# Altium schematic sheet A5000_8MB_MEMCs.SchDoc: ARM2 to ARM3 Adapter
size A3; DocumentNumber: 1; SheetNumber: 2; SheetTotal: 5
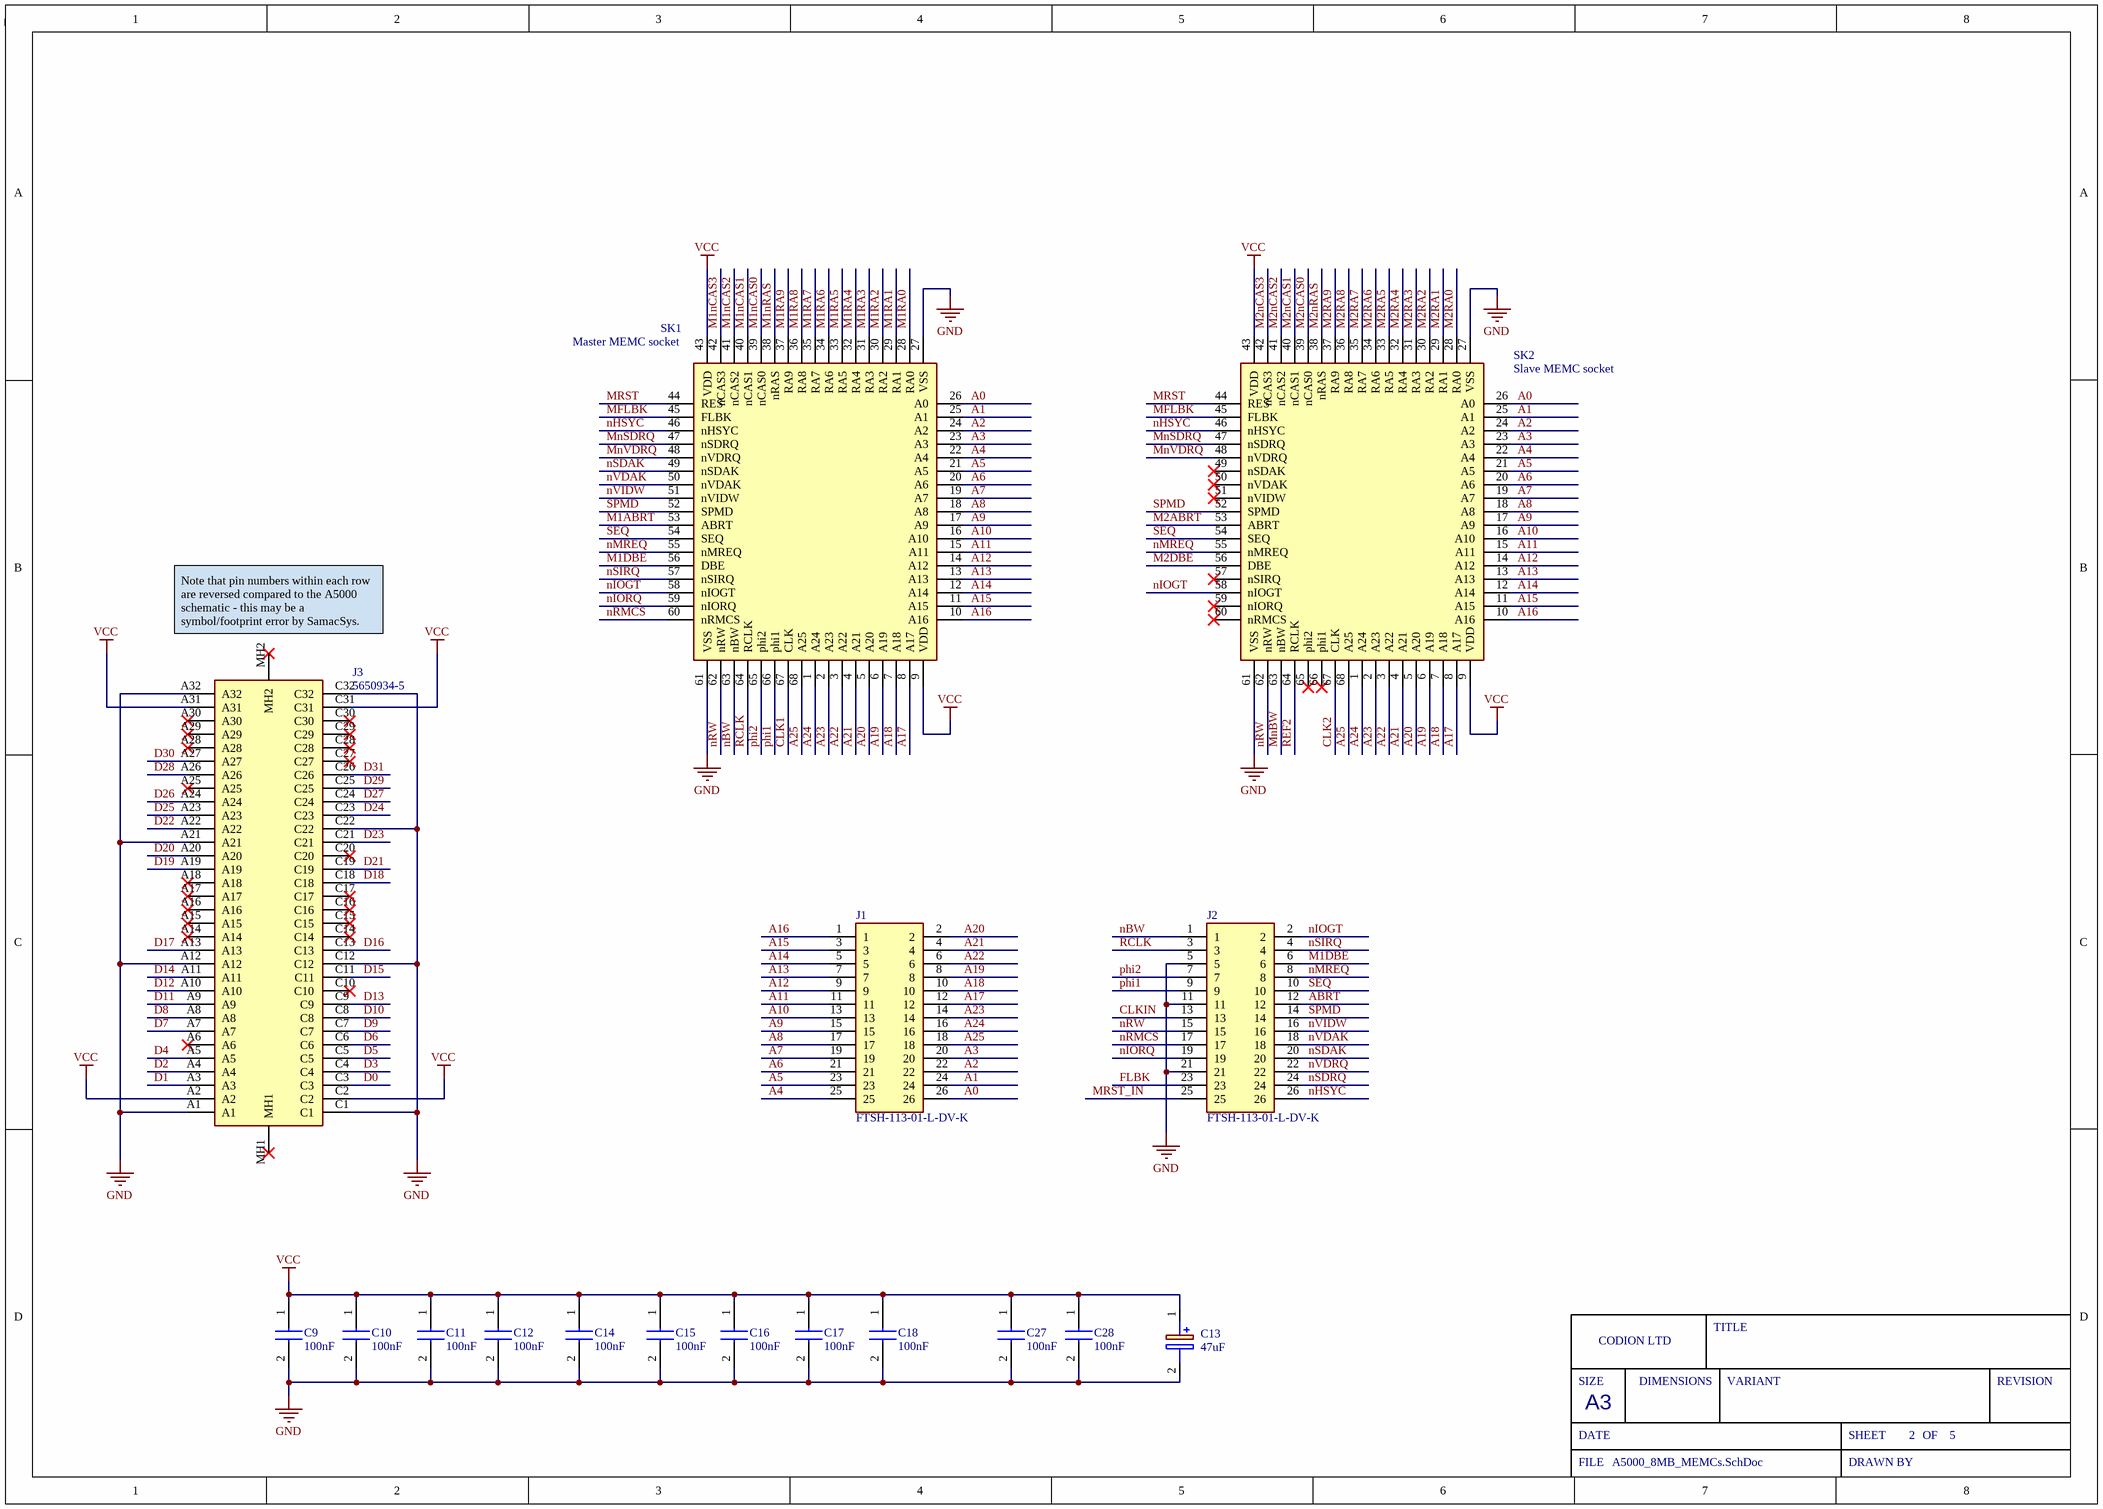
[diagram p0: A5000_8MB_MEMCs.SchDoc]

## Parts
C9  100nF  [0805cap]
C10  100nF  [0805cap]
C11  100nF  [0805cap]
C12  100nF  [0805cap]
C13  47uF  [EEE1AA101SP]
C14  100nF  [0805cap]
C15  100nF  [0805cap]
C16  100nF  [0805cap]
C17  100nF  [0805cap]
C18  100nF  [0805cap]
C27  100nF  [0805cap]
C28  100nF  [0805cap]
J1  FTSH-113-01-L-DV-K  [FTSH-113-XX-YYY-DV-K]
J2  FTSH-113-01-L-DV-K  [FTSH-113-XX-YYY-DV-K]
J3  5650934-5  [56509345]
SK1  Master MEMC socket  [MEMC_Socket]
SK2  Slave MEMC socket  [MEMC_Socket]

## Nets
GND: C9.2 C10.2 C11.2 C12.2 C13.2(-) C14.2 C15.2 C16.2 C17.2 C18.2 C27.2 C28.2 J2.5 J2.11 J2.21 J3.A1 J3.A12 J3.A21 J3.A32 J3.C1 J3.C12 J3.C22 J3.C32 SK1.27(VSS) SK1.61(VSS) SK2.27(VSS) SK2.61(VSS)
VCC: C9.1 C10.1 C11.1 C12.1 C13.1(+) C14.1 C15.1 C16.1 C17.1 C18.1 C27.1 C28.1 J3.A2 J3.A31 J3.C2 J3.C31 SK1.9(VDD) SK1.43(VDD) SK2.9(VDD) SK2.43(VDD)
A0: J1.26 SK1.26(A0) SK2.26(A0)
A1: J1.24 SK1.25(A1) SK2.25(A1)
A2: J1.22 SK1.24(A2) SK2.24(A2)
A3: J1.20 SK1.23(A3) SK2.23(A3)
A4: J1.25 SK1.22(A4) SK2.22(A4)
A5: J1.23 SK1.21(A5) SK2.21(A5)
A6: J1.21 SK1.20(A6) SK2.20(A6)
A7: J1.19 SK1.19(A7) SK2.19(A7)
A8: J1.17 SK1.18(A8) SK2.18(A8)
A9: J1.15 SK1.17(A9) SK2.17(A9)
A10: J1.13 SK1.16(A10) SK2.16(A10)
A11: J1.11 SK1.15(A11) SK2.15(A11)
A12: J1.9 SK1.14(A12) SK2.14(A12)
A13: J1.7 SK1.13(A13) SK2.13(A13)
A14: J1.5 SK1.12(A14) SK2.12(A14)
A15: J1.3 SK1.11(A15) SK2.11(A15)
A16: J1.1 SK1.10(A16) SK2.10(A16)
A17: J1.12 SK1.8(A17) SK2.8(A17)
A18: J1.10 SK1.7(A18) SK2.7(A18)
A19: J1.8 SK1.6(A19) SK2.6(A19)
A20: J1.2 SK1.5(A20) SK2.5(A20)
A21: J1.4 SK1.4(A21) SK2.4(A21)
A22: J1.6 SK1.3(A22) SK2.3(A22)
A23: J1.14 SK1.2(A23) SK2.2(A23)
A24: J1.16 SK1.1(A24) SK2.1(A24)
A25: J1.18 SK1.68(A25) SK2.68(A25)
ABRT: J2.12
CLK1: SK1.67(CLK)
CLK2: SK2.67(CLK)
CLKIN: J2.13
D0: J3.C3
D1: J3.A3
D2: J3.A4
D3: J3.C4
D4: J3.A5
D5: J3.C5
D6: J3.C6
D7: J3.A7
D8: J3.A8
D9: J3.C7
D10: J3.C8
D11: J3.A9
D12: J3.A10
D13: J3.C9
D14: J3.A11
D15: J3.C11
D16: J3.C13
D17: J3.A13
D18: J3.C18
D19: J3.A19
D20: J3.A20
D21: J3.C19
D22: J3.A22
D23: J3.C21
D24: J3.C23
D25: J3.A23
D26: J3.A24
D27: J3.C24
D28: J3.A26
D29: J3.C25
D30: J3.A27
D31: J3.C26
FLBK: J2.23
M1ABRT: SK1.53(ABRT)
M1DBE: J2.6 SK1.56(DBE)
M1nCAS0: SK1.39(nCAS0)
M1nCAS1: SK1.40(nCAS1)
M1nCAS2: SK1.41(nCAS2)
M1nCAS3: SK1.42(nCAS3)
M1nRAS: SK1.38(nRAS)
M1RA0: SK1.28(RA0)
M1RA1: SK1.29(RA1)
M1RA2: SK1.30(RA2)
M1RA3: SK1.31(RA3)
M1RA4: SK1.32(RA4)
M1RA5: SK1.33(RA5)
M1RA6: SK1.34(RA6)
M1RA7: SK1.35(RA7)
M1RA8: SK1.36(RA8)
M1RA9: SK1.37(RA9)
M2ABRT: SK2.53(ABRT)
M2DBE: SK2.56(DBE)
M2nCAS0: SK2.39(nCAS0)
M2nCAS1: SK2.40(nCAS1)
M2nCAS2: SK2.41(nCAS2)
M2nCAS3: SK2.42(nCAS3)
M2nRAS: SK2.38(nRAS)
M2RA0: SK2.28(RA0)
M2RA1: SK2.29(RA1)
M2RA2: SK2.30(RA2)
M2RA3: SK2.31(RA3)
M2RA4: SK2.32(RA4)
M2RA5: SK2.33(RA5)
M2RA6: SK2.34(RA6)
M2RA7: SK2.35(RA7)
M2RA8: SK2.36(RA8)
M2RA9: SK2.37(RA9)
MFLBK: SK1.45(FLBK) SK2.45(FLBK)
MnBW: SK2.63(nBW)
MnSDRQ: SK1.47(nSDRQ) SK2.47(nSDRQ)
MnVDRQ: SK1.48(nVDRQ) SK2.48(nVDRQ)
MRST: SK1.44(RES) SK2.44(RES)
MRST_IN: J2.25
nBW: J2.1 SK1.63(nBW)
nHSYC: J2.26 SK1.46(nHSYC) SK2.46(nHSYC)
nIOGT: J2.2 SK1.58(nIOGT) SK2.58(nIOGT)
nIORQ: J2.19 SK1.59(nIORQ)
nMREQ: J2.8 SK1.55(nMREQ) SK2.55(nMREQ)
nRMCS: J2.17 SK1.60(nRMCS)
nRW: J2.15 SK1.62(nRW) SK2.62(nRW)
nSDAK: J2.20 SK1.49(nSDAK)
nSDRQ: J2.24
nSIRQ: J2.4 SK1.57(nSIRQ)
nVDAK: J2.18 SK1.50(nVDAK)
nVDRQ: J2.22
nVIDW: J2.16 SK1.51(nVIDW)
phi1: J2.9 SK1.66(phi1)
phi2: J2.7 SK1.65(phi2)
RCLK: J2.3 SK1.64(RCLK)
REF2: SK2.64(RCLK)
SEQ: J2.10 SK1.54(SEQ) SK2.54(SEQ)
SPMD: J2.14 SK1.52(SPMD) SK2.52(SPMD)

Not connected (* = marked no-connect by the designer): J3 A6* A14* A15* A16* A17* A18* A25* A28* A29* A30* C10* C14* C15* C16* C17* C20* C27* C28* C29* C30* MH1* MH2*; SK2 49(nSDAK)* 50(nVDAK)* 51(nVIDW)* 57(nSIRQ)* 59(nIORQ)* 60(nRMCS)* 65(phi2)* 66(phi1)*

## Notes on the sheet
- (near J3) Note that pin numbers within each row are reversed compared to the A5000 schematic - this may be a symbol/footprint error by SamacSys.
- SIZE
- CODION LTD
- DIMENSIONS
- TITLE
- VARIANT
- REVISION
- DATE
- A3
- SHEET
- OF
- FILE
- DRAWN BY

## Library data of the parts
C9-C12 C14-C18 C27 C28 = 100nF0805: Capacitor; Manufacturer_Name: TDK; Manufacturer_Part_Number: C2012X7R1H104K125AM; Datasheet Link: https://product.tdk.com/info/en/catalog/datasheets/mlcc_commercial_midvoltage_en.pdf; Height: 1.45mm; Mouser Part Number: 810-C2012X7R1H104KT5; Mouser Price/Stock: https://www.mouser.com/Search/Refine.aspx?Keyword=810-C2012X7R1H104KT5; Arrow Part Number: C2012X7R1H104K125AM; Arrow Price/Stock: https://www.arrow.com/en/products/c2012x7r1h104k125am/tdk; LCSC Part #: C111492
C13 = EEE1VA470WP: Capacitor Polarised; Manufacturer_Name: Panasonic; Datasheet Link: http://industrial.panasonic.com/cdbs/www-data/pdf/RDE0000/ABA0000C1145.pdf; Height: 7.8mm; Manufacturer_Part_Number: EEE1VA470WP
J1 J2 = FTSH-113-01-L-DV-K: Connector; Manufacturer_Name: SAMTEC; Datasheet Link: http://suddendocs.samtec.com/prints/ftsh-1xx-xx-xxx-dv-xxx-xxx-mkt.pdf; Manufacturer_Part_Number: FTSH-113-01-L-DV-K; Mouser Part Number: 200-FTSH11301LDVK; Mouser Price/Stock: https://www.mouser.co.uk/ProductDetail/Samtec/FTSH-113-01-L-DV-K?qs=iT52DjcXudtZOdiFTGniSQ%3D%3D; Arrow Part Number: FTSH-113-01-L-DV-K; Arrow Price/Stock: https://www.arrow.com/en/products/ftsh-113-01-l-dv-k/samtec
J3 = 5650934-5: Connector; Manufacturer_Name: TE Connectivity; Datasheet Link: https://datasheet.datasheetarchive.com/originals/distributors/Datasheets_SAMA/9abbe19037fbf7301e49f31c79c0c77d.pdf; Height: 11.51mm; Manufacturer_Part_Number: 5650934-5; Mouser Part Number: 571-5650934-5; Mouser Price/Stock: https://www.mouser.co.uk/ProductDetail/TE-Connectivity/5650934-5?qs=DpCaYn0bdggz0Lybp365wg%3D%3D; Arrow Part Number: 5650934-5; Arrow Price/Stock: https://www.arrow.com/en/products/5650934-5/te-connectivity
SK1 SK2 = MEMC_Skt: MEMC socket; Manufacturer_Name: 3M; Manufacturer_Part_Number: 8468-21B1-RK-TR; Datasheet Link: https://www.arrow.com/en/products/8468-21b1-rk-tr/3m; Height: 4.6mm; Mouser Part Number: 517-8468-21B1-RK-TR; Mouser Price/Stock: https://www.mouser.co.uk/ProductDetail/3M-Electronic-Solutions-Division/8468-21B1-RK-TR?qs=X%2F%2F06fXhnJ18zOj3KK47CQ%3D%3D; Arrow Part Number: 8468-21B1-RK-TR; Arrow Price/Stock: https://www.arrow.com/en/products/8468-21b1-rk-tr/3m